# Altium schematic sheet VISUR_проверочная плата.SchDoc
size 420 x 297 mm; Address1: Address1; Address2: Address2; Address3: Address3; Address4: Address4; DocumentNumber: АБВГ.123456.001 Э3; SheetNumber: 1; Scale: 1:1; DocumentType: Схема электрическая принципиальная; FirstReferrence: АБВГ.123456.001
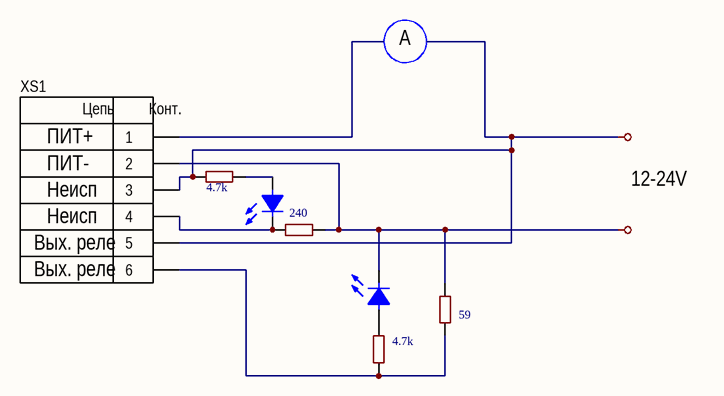
[diagram p0: VISUR_проверочная плата.SchDoc]

## Parts
(Parts that share a designator on the sheet are numbered #1, #2 ... from top to bottom, then left to right.)
R?#1  4.7k  [RES: 0805]
R?#2  240  [RES: 0805]
R?#3  59  [RES: 0805]
R?#4  4.7k  [RES: 0805]
VD?#1  (no value)  [LED: 0402B]
VD?#2  (no value)  [LED: 0402B]
XS1  15EDGVC-3.81-06P  [CON: 15EDGVC-3.81-06P]  (value not drawn)

## Nets
GND: R?#1.1 R?#2.2 R?#3.1 VD?#2.2(C) XS1.2 XS1.3 XS1.5
NetR?#1_2: R?#1.2 VD?#1.1(A)
NetR?#2_1: R?#2.1 VD?#1.2(C) XS1.4
NetR?#3_2: R?#3.2 R?#4.1 XS1.6
NetR?#4_2: R?#4.2 VD?#2.1(A)

Not connected (* = marked no-connect by the designer): XS1 1

## Notes on the sheet
- A
- ПИТ+
- ПИТ-
- 12-24V
- (near XS1) Вых. реле
- (near XS1) Неисп
- Перв. примен.
- Справ. №
- Подп. и дата
- Инв. № дубл.
- Взам. инв. №
- Разраб.
- Изм.
- Лист
- № докум.
- Подп.
- Дата
- Лит.
- Масса
- Масштаб
- Пров.
- Т.контр.
- Листов
- Инв. № подл.
- Утв.
- Н.контр.
- 2.106-A3
- Копировал
- Формат А3
- (in symbol 15EDGVC-3.81-06P) Цепь; Конт.

## Library data of the parts
R?#1-R?#4 = Resistor_0805: Manufacturer: Yageo; PartNumber: RC0805JR-07100RL; ValueManufacturerPartNumber: Resistor film, 100R, ±5%, 0805, 0.125W, -55...+125°C; TypeResistor: Resistor film; Power: 0.125W; Tolerance: ±5%; Value: 100R; Package: 0805; HelpURL: https://www.digikey.com/product-detail/en/yageo/RC0805JR-07100RL/311-100ARCT-ND/731185; Temperature: -55...+125°C
VD?#1 VD?#2 = LED_single: ValueManufacturerPartNumber: LED, Green, *, *, *, -55...+150°C; TypeDiode: LED; ColorParameter: Green; Manufacturer: *; Package: *; HelpURL: *; Temperature: -55...+150°C; Current: *; VoltageDrop: *; PartNumber: *; Color: GREEN
XS1 = 15EDGVC-3.81-06P: ComponentLink1Description: Datasheet; ComponentLink1URL: https://neokt.ru/ru/katalog/15edgvc/15edgvc-3-81-06p-14-00a-h